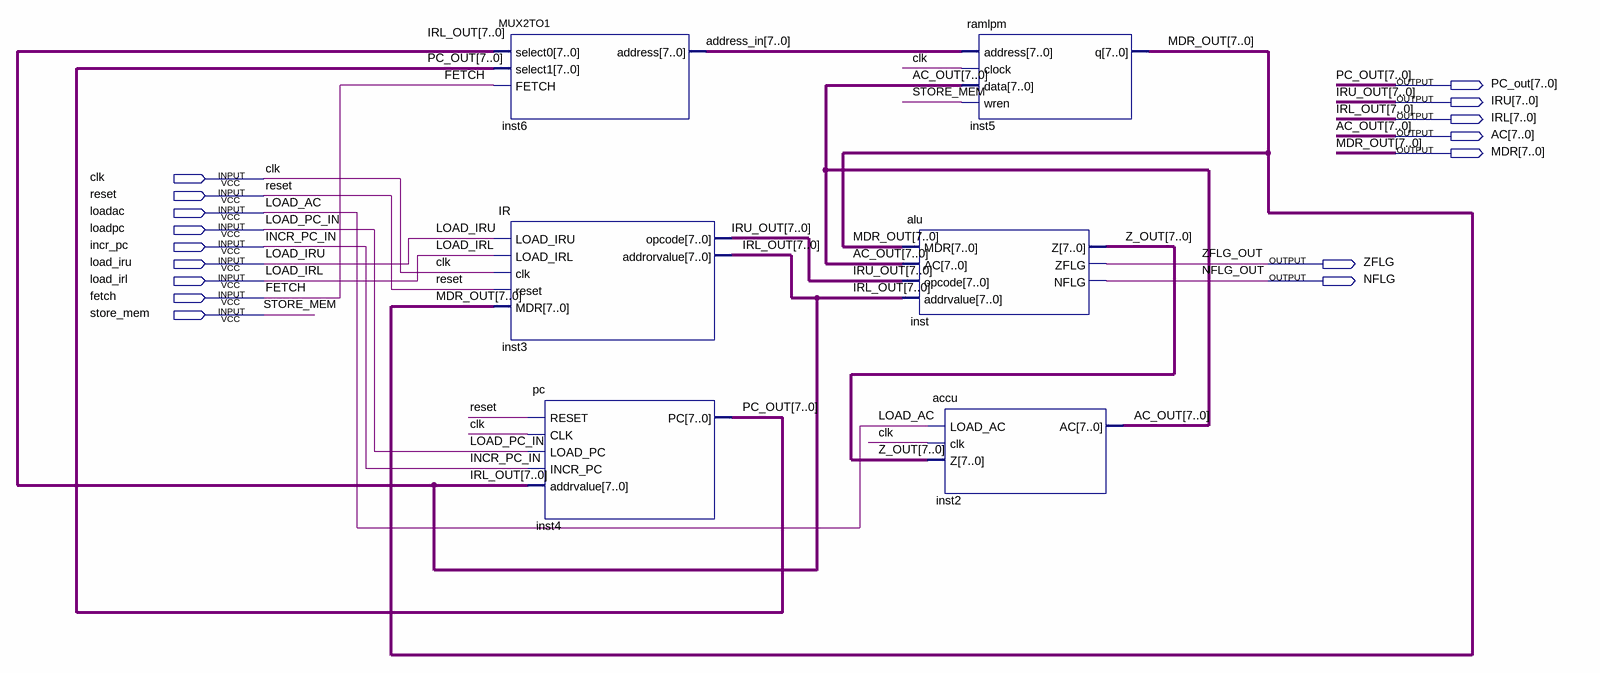
[diagram p0: schematic sheet]
// Quartus schematic CTLunit.bdf as structural Verilog: 6 symbols, 16 pins
module CTLunit (
  input  clk,
  input  reset,
  input  loadac,
  input  loadpc,
  input  incr_pc,
  input  load_iru,
  input  load_irl,
  input  fetch,
  input  store_mem,
  output [7:0] PC_out,
  output [7:0] IRU,
  output [7:0] IRL,
  output [7:0] AC,
  output [7:0] MDR,
  output ZFLG,
  output NFLG
);

  wire [7:0] address_in, Z_OUT;

  MUX2TO1 inst6 (.select0(IRL), .select1(PC_out), .FETCH(fetch), .address(address_in));
  IR inst3 (
    .LOAD_IRU(load_iru), .LOAD_IRL(load_irl), .clk(clk), .reset(reset), .MDR(MDR), .opcode(IRU),
    .addrorvalue(IRL));
  pc inst4 (.RESET(reset), .CLK(clk), .LOAD_PC(loadpc), .INCR_PC(incr_pc), .addrvalue(IRL), .PC(PC_out));
  ramlpm inst5 (.address(address_in), .clock(clk), .data(AC), .wren(store_mem), .q(MDR));
  alu inst (.MDR(MDR), .AC(AC), .opcode(IRU), .addrvalue(IRL), .Z(Z_OUT), .ZFLG(ZFLG), .NFLG(NFLG));
  accu inst2 (.LOAD_AC(loadac), .clk(clk), .Z(Z_OUT), .AC(AC));

  // Other names for the same wires on the sheet: AC_OUT[7:0] = AC; INCR_PC_IN = incr_pc; IRL_OUT[7:0] = IRL;
  //   IRU_OUT[7:0] = IRU; LOAD_AC = loadac; LOAD_PC_IN = loadpc; MDR_OUT[7:0] = MDR; NFLG_OUT = NFLG; ZFLG_OUT = ZFLG
endmodule
